# EAGLE schematic Mikrobus-PIC32MX (EAGLE 6.6.0)
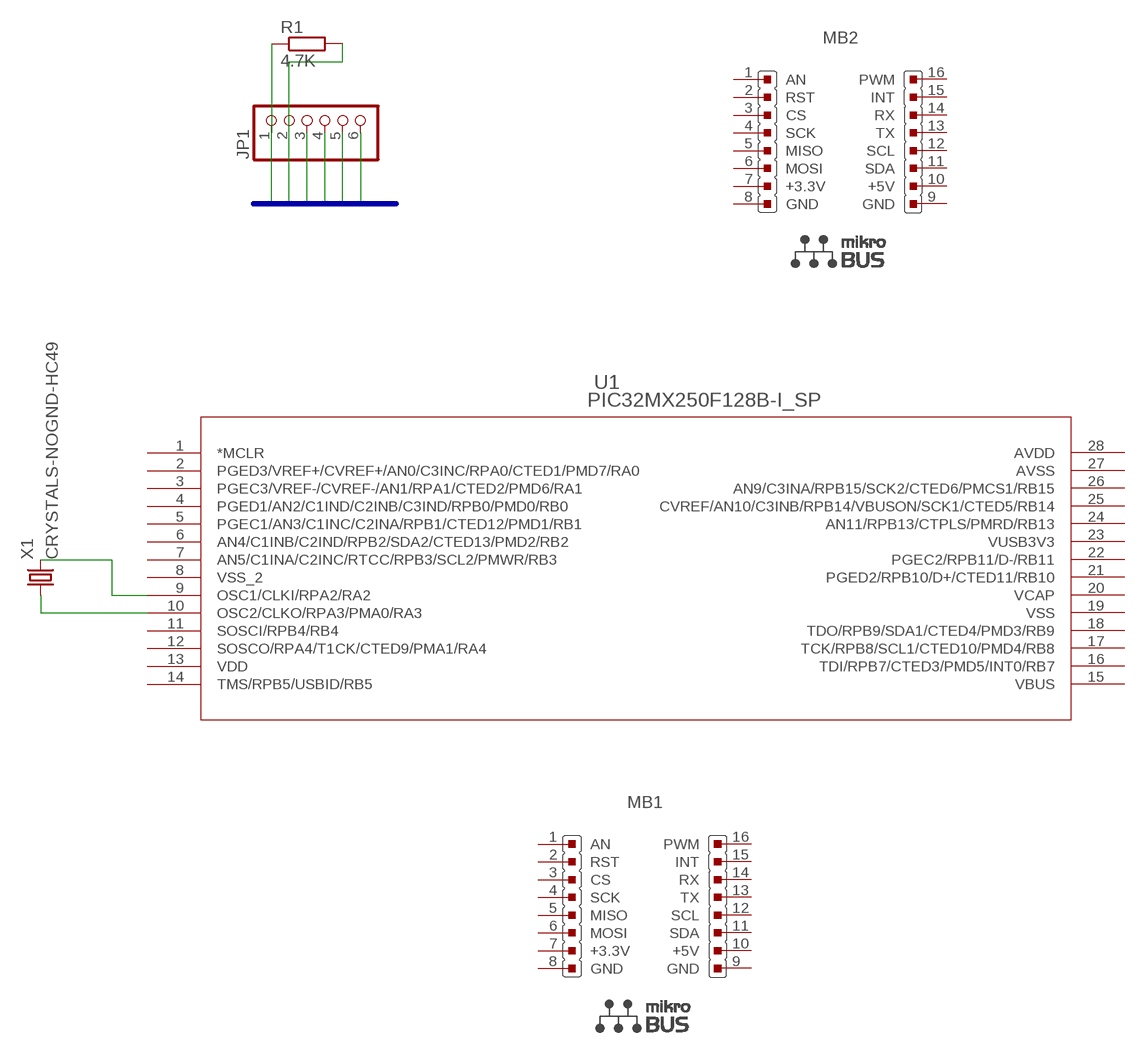
[diagram p0: schematic, sheet 1]

## Parts
JP1  PINHD-1X6  [1X06]
MB1  MIKROBUS  [MIKROBUS]
MB2  MIKROBUS  [MIKROBUS]
R1  4.7K  R-EU_0204/5  [0204/5]
U1  PIC32MX250F128B-I_SP  [SPDIP28_300MC]
X1  CRYSTALS-NOGND-HC49  [HC49]

## Nets
MCRL: JP1.1 R1.1
N$1: U1.9(OSC1/CLKI/RPA2/RA2) X1.2
N$2: U1.10(OSC2/CLKO/RPA3/PMA0/RA3) X1.1
PGC: JP1.5
PGD: JP1.4
PGM: JP1.6
VDD: JP1.2 R1.2
VSS: JP1.3
Unconnected: MB1.1(AN) MB1.2(RST) MB1.3(CS) MB1.4(SCK) MB1.5(MISO) MB1.6(MOSI) MB1.7(+3.3V) MB1.8(GND) MB1.9(GND) MB1.10(+5V) MB1.11(SDA) MB1.12(SCL) MB1.13(TX) MB1.14(RX) MB1.15(INT) MB1.16(PWM) MB2.1(AN) MB2.2(RST) MB2.3(CS) MB2.4(SCK) MB2.5(MISO) MB2.6(MOSI) MB2.7(+3.3V) MB2.8(GND) MB2.9(GND) MB2.10(+5V) MB2.11(SDA) MB2.12(SCL) MB2.13(TX) MB2.14(RX) MB2.15(INT) MB2.16(PWM) U1.1(*MCLR) U1.2(PGED3/VREF+/CVREF+/AN0/C3INC/RPA0/CTED1/PMD7/RA0) U1.3(PGEC3/VREF-/CVREF-/AN1/RPA1/CTED2/PMD6/RA1) U1.4(PGED1/AN2/C1IND/C2INB/C3IND/RPB0/PMD0/RB0) U1.5(PGEC1/AN3/C1INC/C2INA/RPB1/CTED12/PMD1/RB1) U1.6(AN4/C1INB/C2IND/RPB2/SDA2/CTED13/PMD2/RB2) U1.7(AN5/C1INA/C2INC/RTCC/RPB3/SCL2/PMWR/RB3) U1.11(SOSCI/RPB4/RB4) U1.12(SOSCO/RPA4/T1CK/CTED9/PMA1/RA4) U1.14(TMS/RPB5/USBID/RB5) U1.16(TDI/RPB7/CTED3/PMD5/INT0/RB7) U1.17(TCK/RPB8/SCL1/CTED10/PMD4/RB8) U1.18(TDO/RPB9/SDA1/CTED4/PMD3/RB9) U1.21(PGED2/RPB10/D+/CTED11/RB10) U1.22(PGEC2/RPB11/D-/RB11) U1.24(AN11/RPB13/CTPLS/PMRD/RB13) U1.25(CVREF/AN10/C3INB/RPB14/VBUSON/SCK1/CTED5/RB14) U1.26(AN9/C3INA/RPB15/SCK2/CTED6/PMCS1/RB15)

## Buses
VPP,VDD,VSS,D39,D40

## Power pins joined to a net without a drawn wire
AVDD: U1.28(AVDD)
AVSS: U1.27(AVSS)
VBUS: U1.15(VBUS)
VCAP: U1.20(VCAP)
VDD: U1.13(VDD)
VSS: U1.19(VSS)
VSS_2: U1.8(VSS_2)
VUSB3V3: U1.23(VUSB3V3)

## Library data of the parts
JP1 = pinhead:PINHD-1X6: PIN HEADER
MB1 MB2 = KS Proto:MIKROBUS: MikroBUS Source: MikroBUS specification <http://www.mikroe.com/downloads/get/1737/mikrobus_specification.pdf> MikroBUS <http://www.mikroe.com/mikrobus/>
R1 = KS Lib2:R-EU_: RESISTOR, European symbol
U1 = Microchip-UltiLib:PIC32MX250F128B-I_SP
X1 = IQD-Frequency-Products:CRYSTALS-NOGND: CRYSTALS CAN NOT GROUNDED